# EAGLE design pentagrammer_0.1 (EAGLE 6.6.0)
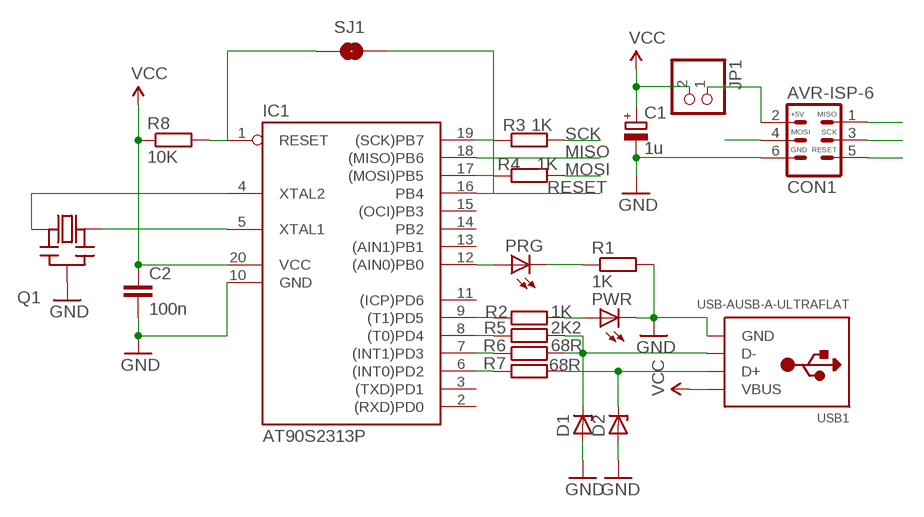
[diagram p0: schematic, sheet 1]

## Parts
C1  1u  CPOL-EUE1.8-4  [E1,8-4]
C2  100n  C-EU025-024X044  [C025-024X044]
CON1  AVR-ISP-6  [ML6]
D1  ZENER-DIODEZD-5  [ZDIO-5]
D2  ZENER-DIODEZD-5  [ZDIO-5]
IC1  AT90S2313P  [DIL20]
JP1  PINHD-1X2  [1X02]
PRG  LED3MM  [LED3MM]
PWR  LED3MM  [LED3MM]
Q1  CERMOSCILL-THM  [CERM_OSC]
R1  1K  R-EU_0204/7  [0204/7]
R2  1K  R-EU_0204/7  [0204/7]
R3  1K  R-EU_0204/7  [0204/7]
R4  1K  R-EU_0204/7  [0204/7]
R5  2K2  R-EU_0204/7  [0204/7]
R6  68R  R-EU_0204/7  [0204/7]
R7  68R  R-EU_0204/7  [0204/7]
R8  10K  R-EU_0204/7  [0204/7]
SJ1  SOLDERJUMPERNO  [SJ_2S-NO]
USB1  USB-AUSB-A-ULTRAFLAT  [USB-A-H]

## Nets
GND: C1.- C2.2 CON1.6(GND) D1.A D2.A IC1.10(GND) PWR.K(C) Q1.P$2(GND) R1.2 USB1.GND USB1.GND2(GND) USB1.GND3(GND)
MISO: CON1.1(MISO) IC1.18((MISO)PB6)
MOSI: CON1.4(MOSI) R4.2
N$1: CON1.2(+5V) JP1.1
N$2: IC1.19((SCK)PB7) R3.1
N$3: IC1.4(XTAL2) Q1.P$1(IN)
N$4: IC1.5(XTAL1) Q1.P$3(OUT)
N$5: IC1.9((T1)PD5) R2.1
N$6: IC1.12((AIN0)PB0) PRG.A
N$7: IC1.8((T0)PD4) R5.1
N$8: IC1.7((INT1)PD3) R6.1
N$9: IC1.6((INT0)PD2) R7.1
N$10: D1.C R5.2 R6.2 USB1.D-
N$11: D2.C R7.2 USB1.D+
N$12: IC1.17((MOSI)PB5) R4.1
N$13: IC1.1(RESET) R8.2 SJ1.1
N$14: PWR.A R2.2
N$15: PRG.K(C) R1.1
RESET: CON1.5(RESET) IC1.16(PB4) SJ1.2
SCK: CON1.3(SCK) R3.2
VCC: C1.+ C2.1 IC1.20(VCC) JP1.2 R8.1 USB1.VBUS
Unconnected: IC1.2((RXD)PD0) IC1.3((TXD)PD1) IC1.11((ICP)PD6) IC1.13((AIN1)PB1) IC1.14(PB2) IC1.15((OCI)PB3)

## Library data of the parts
C1 = rcl:CPOL-EU: POLARIZED CAPACITOR, European symbol
C2 = rcl:C-EU: CAPACITOR, European symbol
CON1 = bigalexeasysolder:AVR-ISP-6: AVR-ISP 6pol; OC_FARNELL: unknown; OC_NEWARK: unknown
D1 D2 = diode:ZENER-DIODE: Z-Diode
IC1 = atmel:AT90S2313: MICROCONTROLLER 2 Kbytes FLASH 128 bytes SRAM 128 bytes EEPROM UART; OC_FARNELL: unknown; OC_NEWARK: unknown
JP1 = pinhead:PINHD-1X2: PIN HEADER
PRG PWR = adafruit:LED: LED OSRAM: - CHIPLED LG R971, LG N971, LY N971, LG Q971, LY Q971, LO R971, LY R971 LH N974, LH R974 LS Q976, LO Q976, LY Q976 LO Q996 - Hyper CHIPLED LW Q18S LB Q993, LB Q99A, LB R99A - SideLED LS A670, LO A670, LY A670, LG A670, LP A670 LB A673, LV A673, LT A673, LW A673 LH A674 LY A675 LS A676, LA A676, LO A676, LY A676, LW A676 LS A679, LY A679, LG A679 - Hyper Micro SIDELED® LS Y876, LA Y876, LO Y876, LY Y876 LT Y87S - SmartLED LW L88C, LW L88S LB L89C, LB L89S, LG L890 LS L89K, LO L89K, LY L89K LS L896, LA L896, LO L896, LY L896 - TOPLED LS T670, LO T670, LY T670, LG T670, LP T670 LSG T670, LSP T670, LSY T670, LOP T670, LYG T670 LG T671, LOG T671, LSG T671 LB T673, LV T673, LT T673, LW T673 LH T674 LS T676, LA T676, LO T676, LY T676, LB T676, LH T676, LSB T676, LW T676 LB T67C, LV T67C, LT T67C, LS T67K, LO T67K, LY T67K, LW E67C LS E67B, LA E67B, LO E67B, LY E67B, LB E67C, LV E67C, LT E67C LW T67C LS T679, LY T679, LG T679 LS T770, LO T770, LY T770, LG T770, LP T770 LB T773, LV T773, LT T773, LW T773 LH T774 LS E675, LA E675, LY E675, LS T675 LS T776, LA T776, LO T776, LY T776, LB T776 LHGB T686 LT T68C, LB T68C - Hyper Mini TOPLED® LB M676 - Mini TOPLED Santana® LG M470 LS M47K, LO M47K, LY M47K Source: http://www.osram.convergy.de/
Q1 = adafruit:CERMOSCILL: Ceramic oscillator with built in capacitors such as ZTT-12MHz http://www.ladyada.net/library/eagle
R1-R8 = rcl:R-EU_: RESISTOR, European symbol
SJ1 = SparkFun:SOLDERJUMPER: Solder Jumper Standard SMD solder jumper. Used to automate production. Two varients : Normally Open and Normally Closed are the same, but have different paste layers. NC will have a large amount of paste and should jumper during reflow.
USB1 = bigalexeasysolder:USB-A: USB type A 'plug' Used for things that can directly connect to a USB port, say USB key

## Board
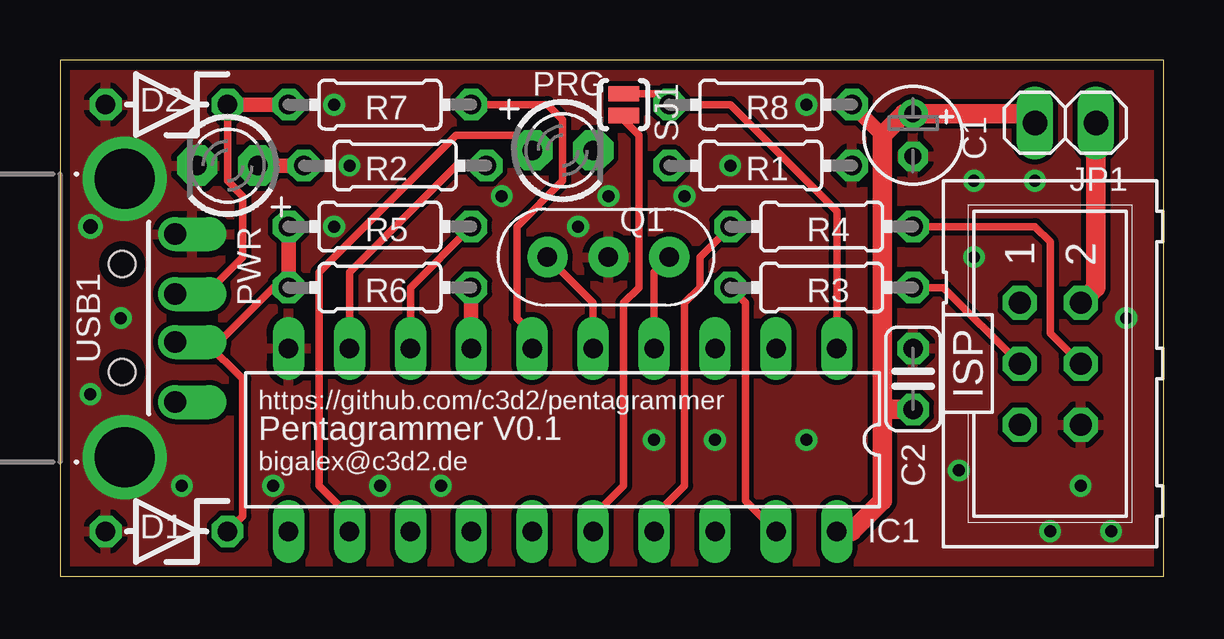
[diagram p1: board, top side]
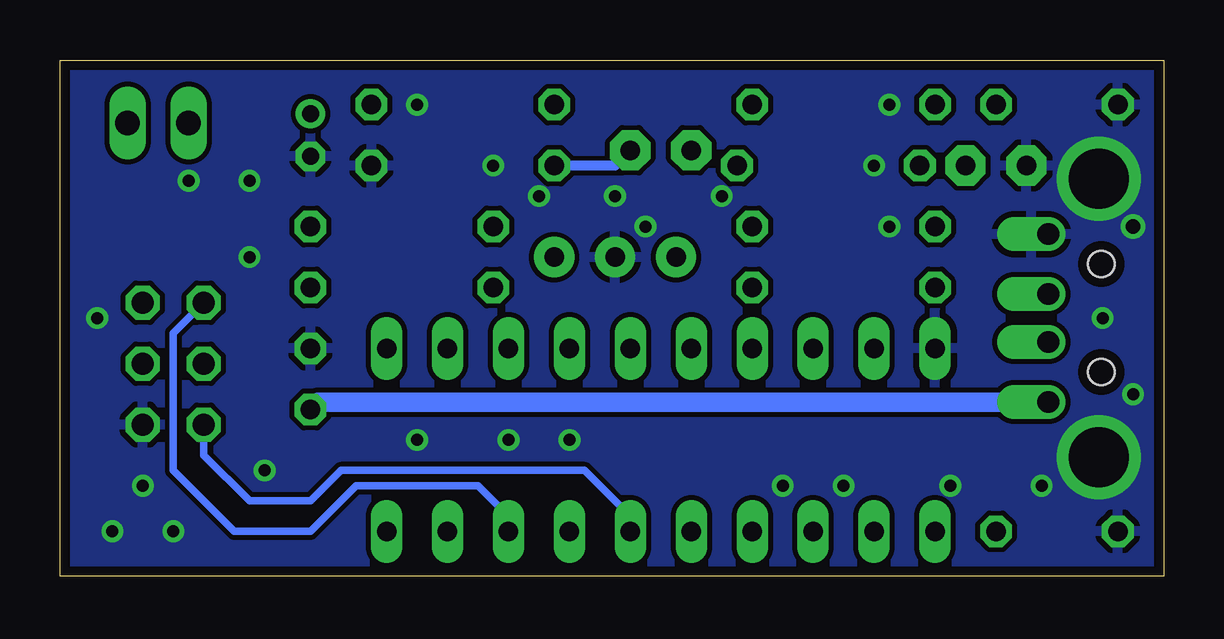
[diagram p2: board, bottom side, seen from below]

Size 46 x 21.5 mm. Coordinates in mm from the lower left corner, seen from the top.
Outline: 0,0 46,0 46,21.5 0,21.5 0,0
Copper layers (1*16): Top 0.035mm / dielectric 1.5mm / Bottom 0.035mm
Design rules "default *": minimum track width 8mil, minimum drill 0.3mm, track to track 8mil, track to pad 8mil, pad to pad 8mil, via to via 8mil, smd to smd 8mil, copper to edge 16mil, drill to drill 8mil, minimum pad ring 10mil, minimum via ring 8mil, stop-mask expansion 4mil, vias tented up to drill 0.6mm, thermal gap 10mil

### Footprints (pad centres in the part's own frame; a part is rotated, then mirrored left to right if it is on the bottom)
E1,8-4 = drill 0.711 pad 1.168: + -0.889,0 | drill 0.711 pad 1.168 octagon: - 0.889,0
C025-024X044 = drill 0.813 octagon: 1 -1.27,0; 2 1.27,0
ML6 = drill 0.914 octagon: 1 -2.54,-1.27; 2 -2.54,1.27; 3 0,-1.27; 4 0,1.27; 5 2.54,-1.27; 6 2.54,1.27
ZDIO-5 = drill 0.813 octagon: A 2.54,0; C -2.54,0
DIL20 = drill 0.813 long: 1 -11.43,-3.81; 2 -8.89,-3.81; 3 -6.35,-3.81; 4 -3.81,-3.81; 5 -1.27,-3.81; 6 1.27,-3.81; 7 3.81,-3.81; 8 6.35,-3.81; 9 8.89,-3.81; 10 11.43,-3.81; 11 11.43,3.81; 12 8.89,3.81; 13 6.35,3.81; 14 3.81,3.81; 15 1.27,3.81; 16 -1.27,3.81; 17 -3.81,3.81; 18 -6.35,3.81; 19 -8.89,3.81; 20 -11.43,3.81
1X02 = drill 1.016 long: 1 -1.27,0; 2 1.27,0
LED3MM = drill 0.813 pad 1.676 octagon: A -1.27,0; K 1.27,0
CERM_OSC = drill 0.813 pad 1.676: P$1 -2.54,0; P$2 0,0; P$3 2.54,0
0204/7 = drill 0.813 octagon: 1 -3.81,0; 2 3.81,0
SJ_2S-NO = smd 0.635 x 1.27: 1 -0.45,0; 2 0.45,0
USB-A-H = drill 0.914 pad 1.27 offset: D+ 2.1,1; D- 2.1,-1; GND 2.1,3.5; VBUS 2.1,-3.5 | drill 2.5: GND2 0,-5.8; GND3 0,5.8 | hole 1.1: -0.1,2.25; -0.1,-2.25

### Placement (x,y rotation side)
C1  35.56,18.37 270 top
C2  35.56,8.21 90 top
CON1  41.27,8.85 270 top
D1  4.45,1.86 180 top
D2  4.45,19.64 180 top
IC1  20.95,5.67 180 top
JP1  41.91,18.88 180 top
PRG  20.95,17.73 0 top
PWR  6.99,17.1 180 top
Q1  22.86,13.29 180 top
R1  29.21,17.1 0 top
R2  13.97,17.1 180 top
R3  31.75,12.02 0 top
R4  31.75,14.56 0 top
R5  13.34,14.56 180 top
R6  13.34,12.02 180 top
R7  13.34,19.64 180 top
R8  29.21,19.64 180 top
SJ1  23.5,19.64 270 top
USB1  2.7,10.75 0 top

### Tracks (layer width: path | path; a pad name or v marks a point on that pad's centre or on a via)
GND  (via drill 0.5 pad 0.5, 0.6)
  other vias: 8.89,3.76 13.34,3.76 15.88,3.76 5.08,3.76 1.27,7.58 2.54,10.75 1.27,14.56 24.77,5.67 27.3,5.67 31.11,5.67 37.47,4.4 41.27,1.86 43.81,1.86 42.55,3.76 38.1,16.46 40.64,16.46 38.1,13.29 44.45,10.75 31.11,19.64 27.94,17.1 26.04,15.83 21.59,14.56 22.86,15.83 18.41,15.83 11.43,19.64 12.06,17.1 11.43,14.56
  pour Top: 0,22.18 46.99,22.18 46.99,5.67 46.99,-0.68 -1.27,-0.68 -1.27,22.18
  pour Bottom: 0,22.18 46.99,22.18 46.99,5.67 46.99,-0.68 -1.27,-0.68 -1.27,22.18
MISO
  Bottom 0.305: CON1.1 41.27,10.12 41.27,4.4 38.73,1.86 35.56,1.86 33.66,3.76 28.57,3.76 27.3,2.49 IC1.18
MOSI
  Top 0.305: R4.2 40.64,14.56 41.27,13.93 41.27,10.12 CON1.4
N$1
  Top 0.813: CON1.2 43.18,12.02 JP1.1
N$2
  Top 0.305: IC1.19 28.57,3.13 28.57,11.38 R3.1
N$3
  Top 0.305: Q1.P$1 24.77,12.65 IC1.4
N$4
  Top 0.305: Q1.P$3 22.23,11.38 IC1.5
N$5
  Top 0.305: R2.1 16.51,17.1 12.06,12.65 IC1.9
N$6
  Top 0.305: PRG.A 19.05,18.37 16.51,18.37 10.79,12.65 10.79,3.76 12.06,2.49 IC1.12
N$7
  Top 0.305: R5.1 14.61,12.02 IC1.8
N$8
  Top 0.61: R6.1 IC1.7
N$9
  Top 0.305: IC1.6 19.68,10.12 19.05,10.75 19.05,14.56 20.95,16.46 20.95,19.01 20.32,19.64 R7.1
N$10
  Top 0.305: 6.08,9.75 7.62,8.21 7.62,2.49 D1.C | 6.08,9.75 USB1.D- | R6.2 8.89,12.02 6.62,9.75 6.08,9.75
  Top 0.61: R5.2 R6.2
N$11
  Top 0.305: D2.C 6.99,16.46 7.62,15.83 7.62,13.29 6.08,11.75 USB1.D+
  Top 0.61: D2.C R7.2
N$12
  Top 0.305: IC1.17 24.77,2.49 26.04,3.76 26.04,11.38 26.67,12.02 26.67,13.29 R4.1
N$13
  Top 0.305: SJ1.1 24.95,20.09 R8.2 27.94,19.64 32.38,15.2 IC1.1
N$14
  Top 0.61: PWR.A R2.2
N$15
  Bottom 0.406: PRG.K 22.86,17.1 R1.1
RESET
  Top 0.305: SJ1.2 23.5,19.01 24.13,18.37 24.13,12.02 23.5,11.38 23.5,3.76 22.23,2.49 IC1.16
  Bottom 0.305: CON1.5 40.01,5.04 38.1,3.13 35.56,3.13 34.29,4.4 24.13,4.4 22.23,2.49 IC1.16
SCK
  Top 0.305: R3.2 36.83,12.02 CON1.3
VCC
  Top 0.61: R8.1 34.29,18.37
  Top 0.813: JP1.2 40.26,19.26 C1.+ 35.18,19.26 34.29,18.37 34.29,6.94 | IC1.20 33.02,1.86 34.29,3.13 34.29,6.94 | 34.29,6.94 C2.1
  Bottom 0.813: USB1.VBUS 35.25,7.25 C2.1

### Text on the board
tPlace: https://github.com/c3d2/pentagrammer | Pentagrammer V0.1 | bigalex@c3d2.de
bStop: Pentagrammer V0.1